# Altium schematic sheet Sheet2.SchDoc
size A3; SheetNumber: 1; SheetTotal: 1; SPICEModelCacheEFCQWYKT: <root> / <DocumentId>EFCQWYKT</DocumentId> / <CacheFrame Number="0"> / <Model Name="led0" Kind="MDL"> / <Text>*Typ INFRARED GaAs LED: Vf=1.2V Vr=5V If=40mA trr=3uS / *LED Pinout: 1=A, 2=K / .MODEL LED0 D (IS=93.5P RS=84M N=2.63 BV=5 IBV=10U / + CJO=2.97P VJ=.75 M=.333 TT=4.32U)</Text> / </Model> / </CacheFrame> / </root>
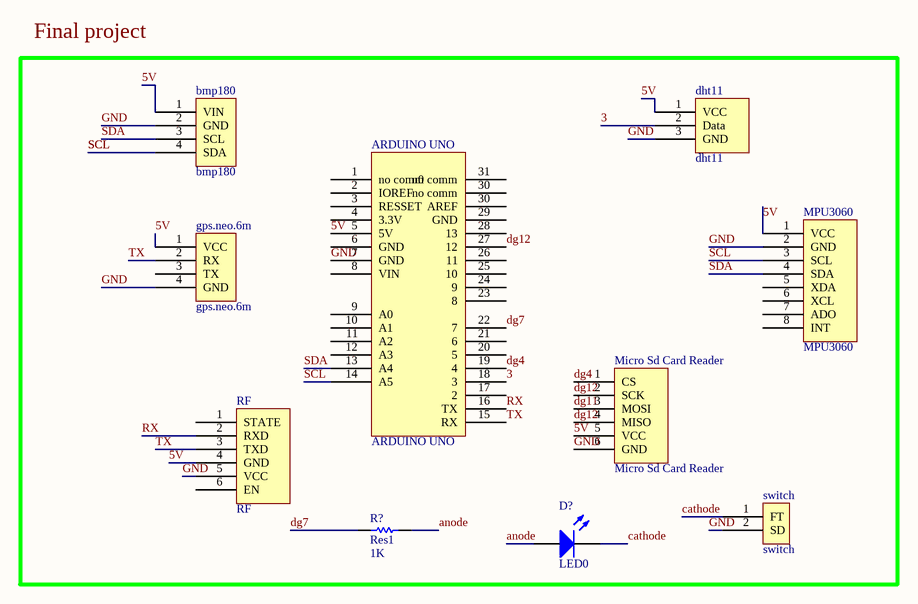
[diagram p0: Sheet2.SchDoc]

## Parts
ARDUINO_UNO  ARDUINO UNO  [ARDUINO UNO]
bmp180  bmp180  [BMP180]
D?  LED0  [LED-0]
dht11  dht11  [DHT11]
gps.neo.6m  gps.neo.6m  [gps.neo.6m]
Micro_Sd_Card_Reader  Micro Sd Card Reader  [Micro Sd Card Reader]
MPU3060  MPU3060  [mpu6050]
R?  Res1  value 1K  [AXIAL-0.3]
RF  RF  [RF]
switch  switch  [switch]

## Nets
3: ARDUINO_UNO.18(3) dht11.2(Data)
5V: ARDUINO_UNO.5(5V) bmp180.1(VIN) dht11.1(VCC) gps.neo.6m.1(VCC) Micro_Sd_Card_Reader.5(VCC) MPU3060.1(VCC) RF.4(GND)
anode: D?.1(A) R?.2
cathode: D?.2(K) switch.1(FT)
dg4: ARDUINO_UNO.19(4) Micro_Sd_Card_Reader.1(CS)
dg7: ARDUINO_UNO.22(7) R?.1
dg11: Micro_Sd_Card_Reader.3(MOSI)
dg12: ARDUINO_UNO.27(12) Micro_Sd_Card_Reader.2(SCK) Micro_Sd_Card_Reader.4(MISO)
GND: ARDUINO_UNO.7(GND) bmp180.2(GND) dht11.3(GND) gps.neo.6m.4(GND) Micro_Sd_Card_Reader.6(GND) MPU3060.2(GND) RF.5(VCC) switch.2(SD)
RX: ARDUINO_UNO.16(TX) RF.2(RXD)
SCL: ARDUINO_UNO.14(A5) bmp180.4(SDA) MPU3060.3(SCL)
SDA: ARDUINO_UNO.13(A4) bmp180.3(SCL) MPU3060.4(SDA)
TX: ARDUINO_UNO.15(RX) gps.neo.6m.2(RX) RF.3(TXD)

Not connected (* = marked no-connect by the designer): ARDUINO_UNO 1(no_comm) 2(IOREF) 3(RESSET) 4(3.3V) 6(GND) 8(VIN) 9(A0) 10(A1) 11(A2) 12(A3) 17(2) 20(5) 21(6) 23(8) 24(9) 25(10) 26(11) 28(13) 29(GND) 30(AREF) 31(n0_comm); gps.neo.6m 3(TX); MPU3060 5(XDA) 6(XCL) 7(ADO) 8(INT); RF 1(STATE) 6(EN)

## Notes on the sheet
- Labels drawn without touching a wire or pin: Final project

## Library data of the parts
D? = LED0: Typical INFRARED GaAs LED; Published: 8-Jun-2000; LatestRevisionDate: 08-Jul-2005; LatestRevisionNote: Mech Layer 1 removed.; PackageReference: LED-0; Publisher: Altium Limited; PackageDescription: LED; 2 Leads
R? = Res1: Resistor; Published: 8-Jun-2000; LatestRevisionDate: 17-Jul-2002; LatestRevisionNote: Re-released for DXP Platform.; PackageReference: AXIAL-0.3; Publisher: Altium Limited; PackageDescription: Axial Device, Thru-Hole; 2 Leads; 0.3 in Pin Spacing